# EasyEDA Pro project ProPrj_智能车主控V5.0-20251108_2026-08-26.epro, schematic Schematic1

## Sheets
1 Power: Board Name: Board1; Create Date: 2026-05-18; Page Name: P1; Project Name: 智能车主控V5.0-20251108; Schematic Name: Schematic1; Update Date: 2026-05-18; Company: 嘉立创EDA; Page Size: A4; Version: V1.0
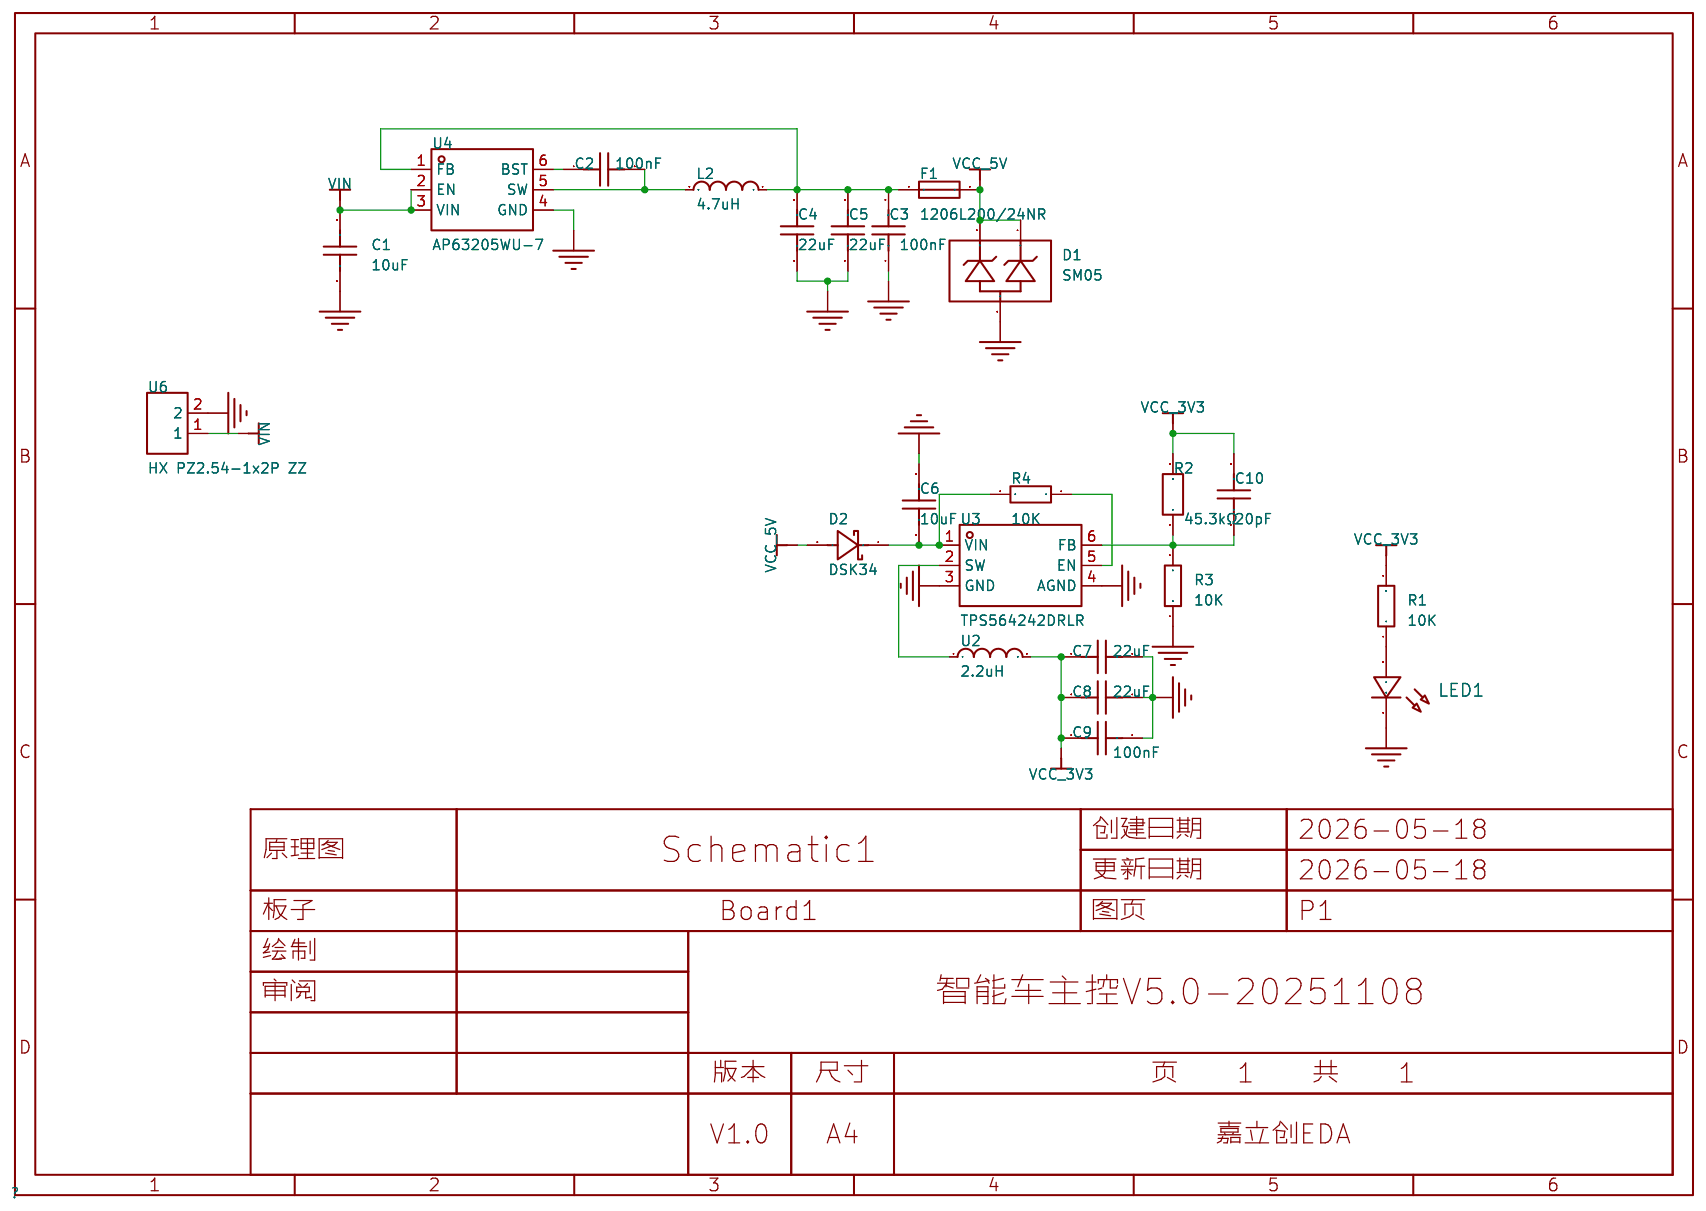
[diagram p5: Power]
2 MCU
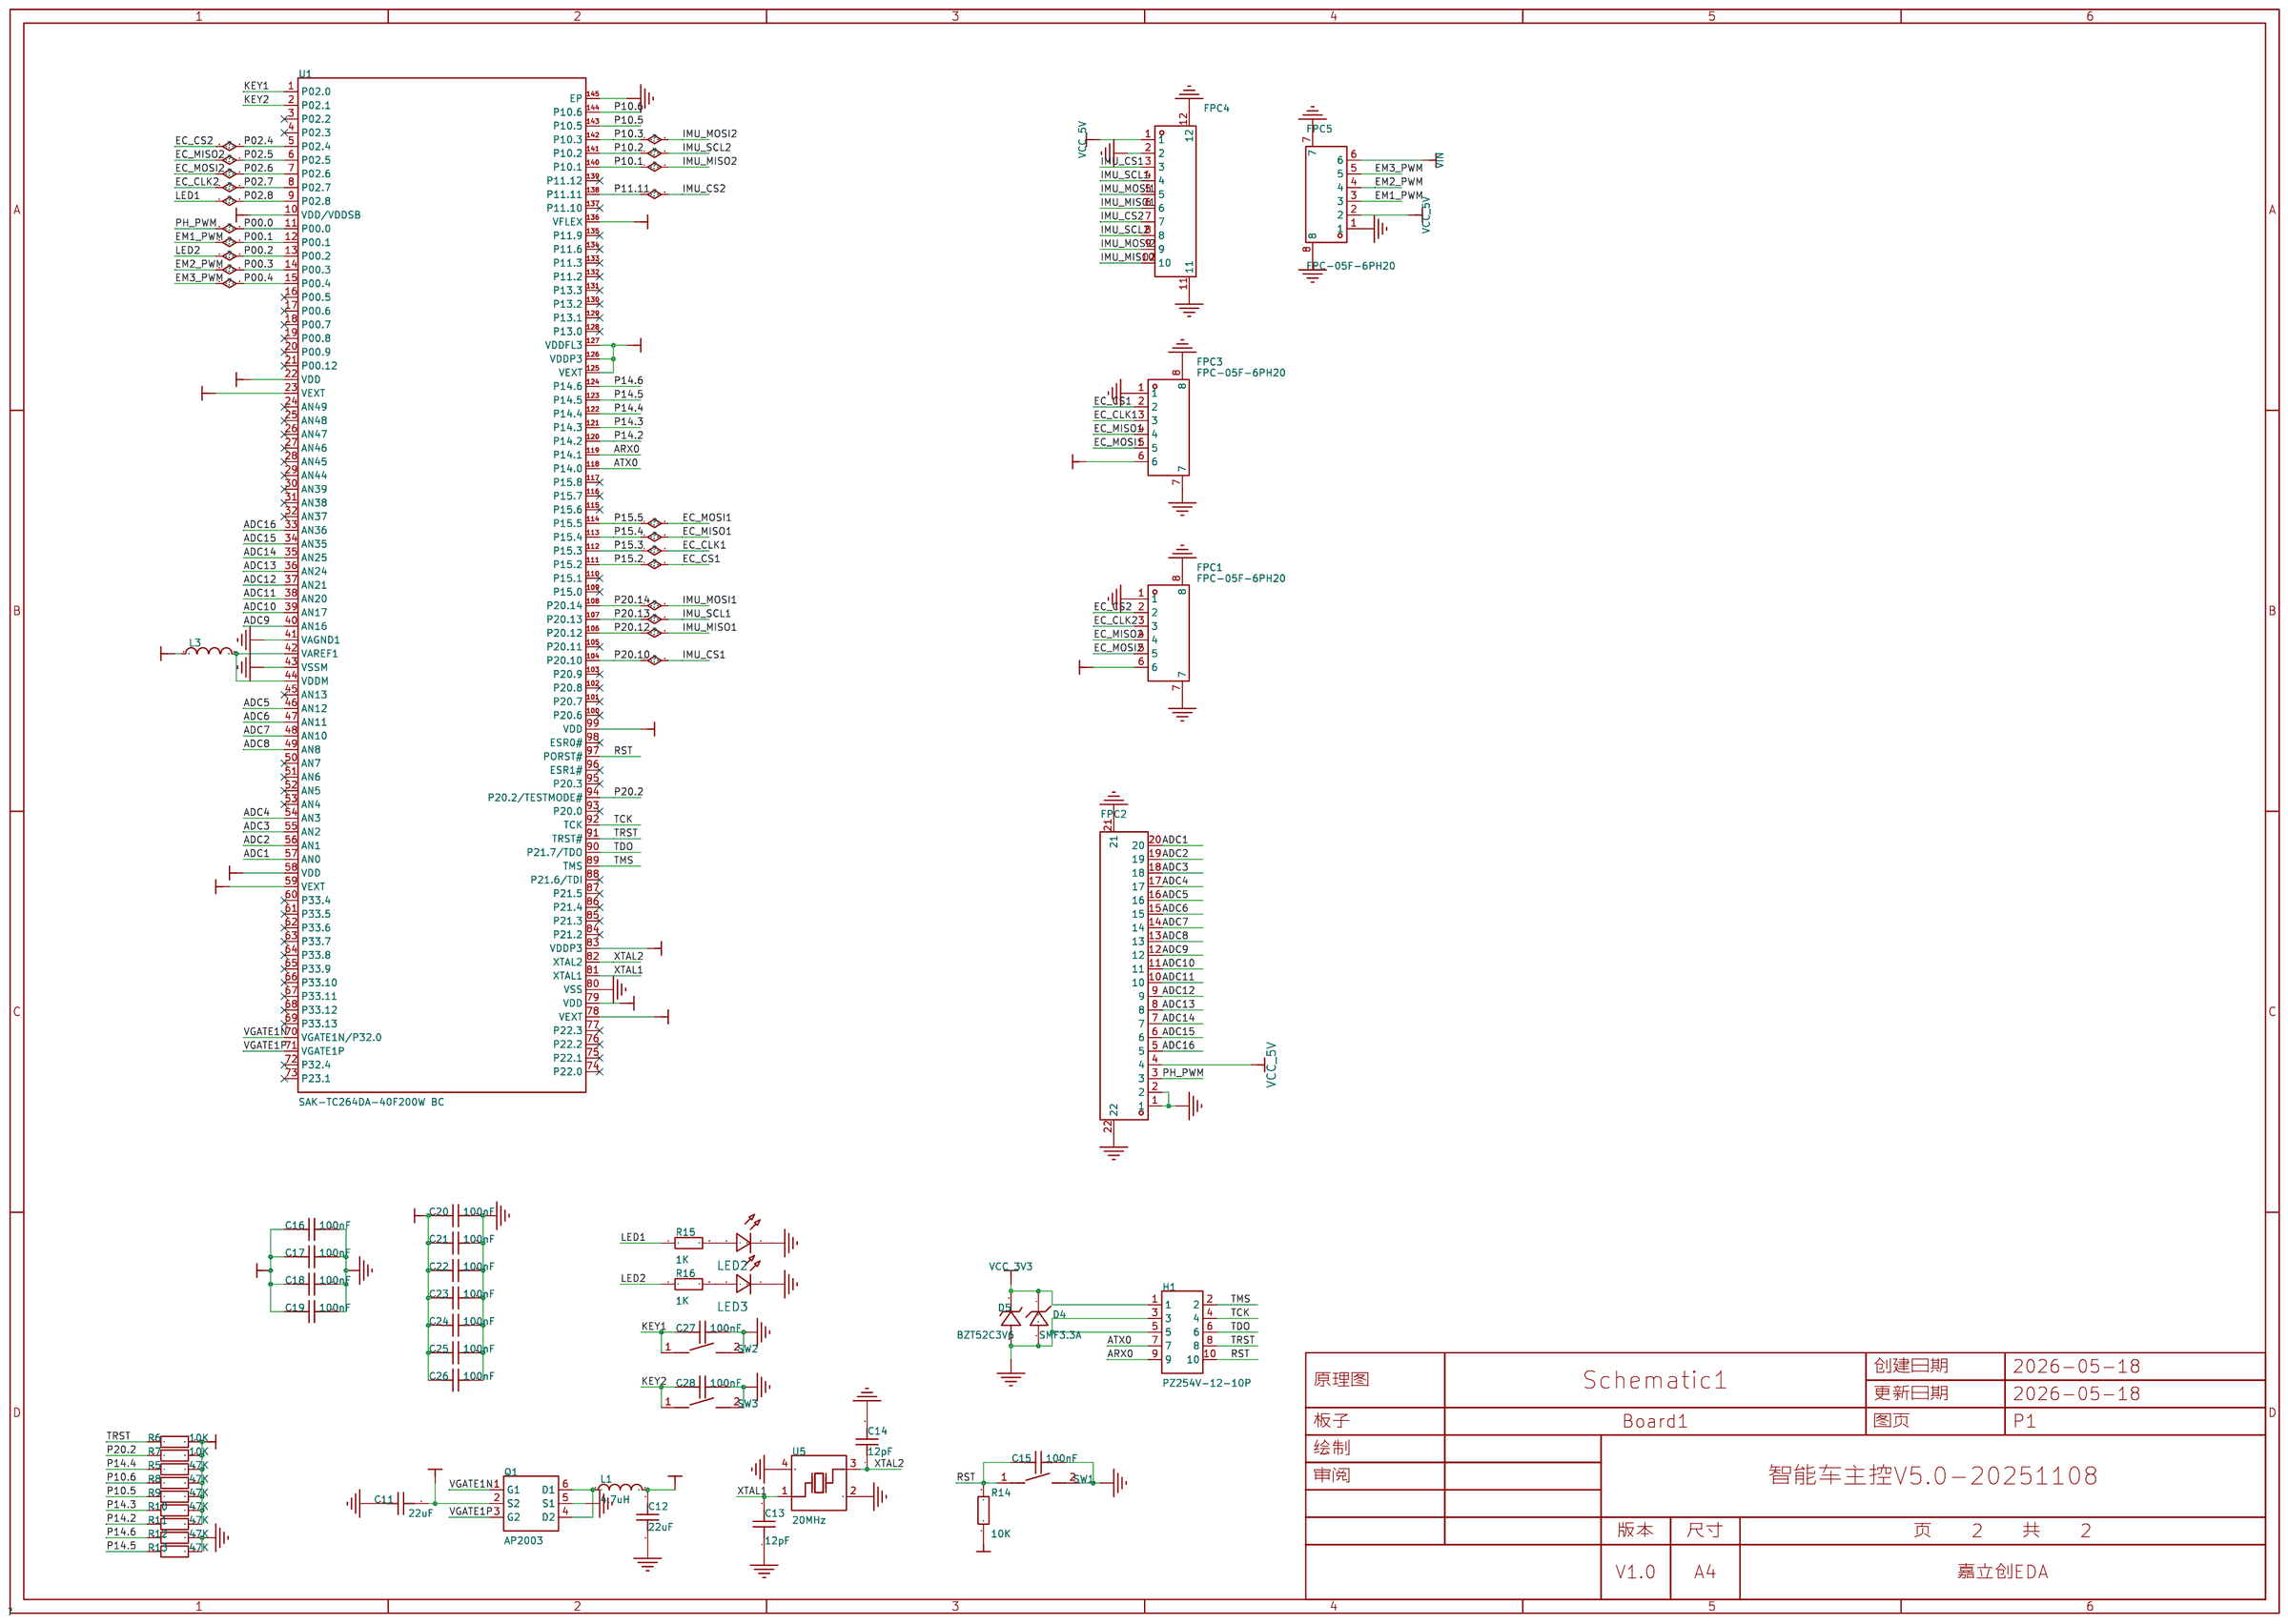
[diagram p6: MCU]

## Parts
sheet MCU
C11  22uF  [C0603]
C12  22uF  [C0603]
C13  12pF  [C0603]
C14  12pF  [C0603]
C15  100nF  [C0603]
C16  100nF  [C0603]
C17  100nF  [C0603]
C18  100nF  [C0603]
C19  100nF  [C0603]
C20  100nF  [C0603]
C21  100nF  [C0603]
C22  100nF  [C0603]
C23  100nF  [C0603]
C24  100nF  [C0603]
C25  100nF  [C0603]
C26  100nF  [C0603]
C27  100nF  [C0603]
C28  100nF  [C0603]
D4  SMF3.3A  [SOD-123_L2.8-W1.8-LS3.7-RD]
D5  BZT52C3V6  [SOD-123_L2.7-W1.6-LS3.7-RD]
FPC1  FPC-05F-6PH20  [FPC-SMD_6P-P0.50_XUNPU_FPC-05F-6PH20]
FPC2  FPC-05F-20PH20  [FPC-SMD_20P-P0.50_XUNPU_FPC-05F-20PH20]
FPC3  FPC-05F-6PH20  [FPC-SMD_6P-P0.50_XUNPU_FPC-05F-6PH20]
FPC4  FPC-05F-10PH15  [FPC-SMD_10P-P0.50_XUNPU_FPC-05F-10PH15]
FPC5  FPC-05F-6PH20  [FPC-SMD_6P-P0.50_XUNPU_FPC-05F-6PH20]
H1  PZ254V-12-10P  [HDR-TH_10P-P2.54-V-M-R2-C5-S2.54]
L1  4.7uH  [IND-SMD_L2.5-W2.0-VLS252012CX-150M]
L3  BLM18EG221SN1D  [L0603]
LED2  -  [LED_0603]
LED3  -  [LED_0603]
Q1  AP2003  [SOT-23-6_L2.9-W1.6-P0.95-LS2.8-BR]
R5  47K  [R0603]
R6  10K  [R0603]
R7  10K  [R0603]
R8  47K  [R0603]
R9  47K  [R0603]
R10  47K  [R0603]
R11  47K  [R0603]
R12  47K  [R0603]
R13  47K  [R0603]
R14  10K  [R0603]
R15  1K  [R0603]
R16  1K  [R0603]
SW1  TS-1088-AR02016  [SW-SMD_L3.9-W3.0-P4.45]
SW2  TS-1088-AR02016  [SW-SMD_L3.9-W3.0-P4.45]
SW3  TS-1088-AR02016  [SW-SMD_L3.9-W3.0-P4.45]
U1  SAK-TC264DA-40F200W BC  [LQFP-144_L20.0-W20.0-P0.50-LS22.0-BL-EP-1]
U5  20MHz  [CRYSTAL-SMD_4P-L2.0-W1.6-BL-2]
sheet Power
C1  10uF  [C0603]
C2  100nF  [C0603]
C3  100nF  [C0603]
C4  22uF  [C0603]
C5  22uF  [C0603]
C6  10uF  [C0603]
C7  22uF  [C0603]
C8  22uF  [C0603]
C9  100nF  [C0603]
C10  20pF  [C0603]
D1  SM05  [SOT-23-3_L2.9-W1.5-P1.90-LS2.6-BR]
D2  DSK34  [SOD-123FL_L2.7-W1.8-LS3.8-RD]
F1  1206L200/24NR  [F1206]
L2  4.7uH  [IND-SMD_L2.5-W2.0-VLS252012CX-150M]
LED1  -  [LED_0603]
R1  10K  [R0603]
R2  45.3kΩ  [R0603]
R3  10K  [R0603]
R4  10K  [R0603]
U2  2.2uH  [IND-SMD_L2.0-W1.6-B]
U3  TPS564242DRLR  [SOT-5X3-6_W1.6-L1.2-P0.50-LS1.6-BL]
U4  AP63205WU-7  [TSOT-23-6_L2.9-W1.6-P0.95-LS2.8-BL]
U6  HX PZ2.54-1x2P ZZ  [HDR-TH_2P-P2.54-V-M-3]

## Library data of the parts
C11-C28 = CAP_0603: Supplier Footprint: 0603
D4 = SMF3.3A_C283866: 极性:单向;反向截止电压(Vrwm):3.3V;钳位电压:8V;峰值脉冲电流(Ipp):25A;峰值脉冲功率(Ppp):200W@10/1000us;击穿电压:5.2V;; LCSC Part Name: 单向TVS 3.3V截止 峰值浪涌电流：25A; Supplier Part: C283866; Manufacturer: DOWO(东沃); Supplier Footprint: SOD-123FL; JLCPCB Part Class: Extended Part; Datasheet: https://item.szlcsc.com/datasheet/SMF3.3A/269417.html; Supplier: LCSC; Polarity: 单向; Reverse Stand-Off Voltage (Vrwm): 3.3V; Clamping Voltage: 8V; Peak Pulse Current (Ipp): 25A; Peak Pulse Power Dissipation (Ppp): 200W@10/1000us; Voltage - Breakdown: 5.2V; Reverse Leakage Current (Ir): 500uA; level of protection: IEC 61000-4-2；IEC 61000-4-4; Type: TVS
D5 = BZT52C3V6_C19077397: 二极管配置:独立式;稳压值(标称值):3.6V;稳压值(范围):3.42V~3.78V;耗散功率(Pd):350mW;; LCSC Part Name: 表面贴装齐纳二极管; Supplier Part: C19077397; Manufacturer: R+O(宏嘉诚); Supplier Footprint: SOD-123; JLCPCB Part Class: Extended Part; Datasheet: https://item.szlcsc.com/datasheet/BZT52C3V6/20275482.html; Supplier: LCSC; Diode Configuration: 独立式; Zener Voltage(Nom): 3.6V; Reverse Leakage Current (Ir): 5uA@1.0V; Zener Voltage(Range): 3.42V~3.78V; Pd - Power Dissipation: 350mW; Impedance(Zzt): 90Ω; Impedance(Zzk): 600Ω; Operating Junction Temperature Range: -55℃~+150℃
FPC1 FPC3 FPC5 = FPC-05F-6PH20: 锁定特性:翻盖式;触点类型:卧贴;触点数量:6P;间距:0.5mm;安装方式:下接;工作温度:-25℃~+85℃;; LCSC Part Name: 翻盖式 卧贴 P数:6P 间距:0.5mm; Supplier Part: C2856796; Manufacturer: XUNPU(讯普); Supplier Footprint: SMD,P=0.5mm,卧贴; JLCPCB Part Class: Extended Part; Datasheet: https://item.szlcsc.com/datasheet/FPC-05F-6PH20/3056894.html; Supplier: LCSC; Locking Feature: 翻盖式; Contact Type: 卧贴; Number of Contacts: 6P; Pitch: 0.5mm; Mounting Type: 下接; FFC, FCB Thickness: 0.3mm; Height Above Board: 2mm; Contact Material: 磷青铜; Contact Plating: 锡; Operating Temperature: -25℃~+85℃; Rated Voltage (Max): 50V; Current Rating (Max): 500mA
FPC2 = FPC-05F-20PH20: 锁定特性:翻盖式;触点类型:卧贴;触点数量:20P;间距:0.5mm;安装方式:下接;工作温度:-25℃~+85℃;; LCSC Part Name: 翻盖式 卧贴 P数:20P 间距:0.5mm; Supplier Part: C2856803; Manufacturer: XUNPU(讯普); Supplier Footprint: SMD,P=0.5mm,卧贴; JLCPCB Part Class: Extended Part; Datasheet: https://item.szlcsc.com/datasheet/FPC-05F-20PH20/3056901.html; Supplier: LCSC; Locking Feature: 翻盖式; Contact Type: 卧贴; Number of Contacts: 20P; Pitch: 0.5mm; Mounting Type: 下接; FFC, FCB Thickness: 0.3mm; Height Above Board: 2mm; Contact Material: 磷青铜; Contact Plating: 锡; Operating Temperature: -25℃~+85℃; Rated Voltage (Max): 50V; Current Rating (Max): 500mA
FPC4 = FPC-05F-10PH15: 锁定特性:翻盖式;触点类型:卧贴;触点数量:10P;间距:0.5mm;安装方式:下接;工作温度:-25℃~+85℃;; LCSC Part Name: 翻盖式 卧贴 P数:10P 间距:0.5mm; Supplier Part: C2856816; Manufacturer: XUNPU(讯普); Supplier Footprint: SMD,P=0.5mm,卧贴; JLCPCB Part Class: Extended Part; Datasheet: https://item.szlcsc.com/datasheet/FPC-05F-10PH15/3056914.html; Supplier: LCSC; Locking Feature: 翻盖式; Contact Type: 卧贴; Number of Contacts: 10P; Pitch: 0.5mm; Mounting Type: 下接; FFC, FCB Thickness: 0.3mm; Height Above Board: 1.5mm; Contact Material: 磷青铜; Contact Plating: 锡; Operating Temperature: -25℃~+85℃; Rated Voltage (Max): 50V; Current Rating (Max): 500mA
H1 = PZ254V-12-10P: 插针结构:2x5P;间距:2.54mm;行距:2.54mm;圆针/方针:方针;安装方式:直插;排数:双排;总PIN位数:10P;额定电流:-;额定电压:-;配合针长度:6mm;塑高:2.5mm;端接针长度:3mm;触头材质:黄铜;触头镀层:-;工作温度:-40℃~+105℃;颜色:黑色;; LCSC Part Name: 2x5P 间距:2.54mm 方针 直插; Supplier Part: C492422; Manufacturer: XFCN(兴飞); Supplier Footprint: 插件,P=2.54mm; JLCPCB Part Class: Extended Part; Datasheet: https://item.szlcsc.com/datasheet/PZ254V-12-10P/502978.html; Supplier: LCSC; Pin Structure: 2x5P; Pitch: 2.54mm; Row Spacing: 2.54mm; Circluar Pins/Square Pins: 方针; Mounting Type: 直插; Number of Rows: 双排; Number of Pins: 10P; Length of Mating Pin: 6mm; Insulation Height: 2.5mm; Length of End Connection Pin: 3mm; Contact Material: 黄铜; Operating Temperature: -40℃~+105℃; Color: 黑色
L1 L2 = FTC252010S4R7MBCA: 电感值:4.7uH;精度:±20%;额定电流:2A;饱和电流(Isat):2.6A;类型:-;; LCSC Part Name: 4.7uH ±20% 2.6A; Supplier Part: C5832360; Manufacturer: cjiang(长江微电); Supplier Footprint: 1008; JLCPCB Part Class: Extended Part; Datasheet: https://item.szlcsc.com/datasheet/FTC252010S4R7MBCA/6763480.html; Supplier: LCSC; Tolerance: ±20%; Current Rating: 2A; Current - Saturation(Isat): 2.6A; DC Resistance(DCR): 160mΩ
L3 = BLM18EG221SN1D: 阻抗@频率:220Ω@100MHz;误差:±25%;直流电阻(DCR):50mΩ;; LCSC Part Name: 单路 0603磁珠 阻抗220Ω@100MHz; Supplier Part: C85827; Manufacturer: muRata(村田); Supplier Footprint: 0603; JLCPCB Part Class: Extended Part; Datasheet: https://item.szlcsc.com/datasheet/BLM18EG221SN1D/87003.html; Supplier: LCSC; Impedance @ Frequency: 220Ω@100MHz; Tolerance: ±25%; DC Resistance(DCR): 50mΩ; Current Rating: 2A; Number of Circuits: 1; Operating Temperature: -55℃~+125℃
LED1-LED3 = LED_0603-R: Supplier Footprint: 0603
Q1 = AP2003: 数量:1个N沟道+1个P沟道;漏源电压(Vdss):20V;连续漏极电流(Id):3A;导通电阻(RDS(on)):100mΩ@2.5V;耗散功率(Pd):800mW;阈值电压(Vgs(th)):1.2V@250uA;; LCSC Part Name: 1个N沟道+1个P沟道 耐压:20V 电流:3A; Supplier Part: C2849575; Manufacturer: ALLPOWER(铨力); Supplier Footprint: SOT-23-6L; JLCPCB Part Class: Extended Part; Datasheet: https://item.szlcsc.com/datasheet/AP2003/3049192.html; Supplier: LCSC; Number: 1个N沟道+1个P沟道; Drain to Source Voltage: 20V; Current - Continuous Drain(Id): 3A; RDS(on): 100mΩ@2.5V; Pd - Power Dissipation: 800mW; Gate Threshold Voltage (Vgs(th)): 1.2V@250uA; Gate Charge(Qg): 5nC@4.5V; Input Capacitance(Ciss): 325pF; Reverse Transfer Capacitance (Crss@Vds): 37pF; Operating Temperature: -55℃~+150℃; Type: N沟道+P沟道; Output Capacitance(Coss): 63pF
R5-R16 = Res_0603: Supplier Footprint: 0603
SW1-SW3 = TS-1088-AR02016: 电路结构:单刀单掷;按钮形状:圆形按钮;作用力:1.6N;安装方式:立贴;开关长度:4mm;开关宽度:3mm;开关高度:2mm;带支架:不带支架;触点电流:50mA;额定电压:12V;工作寿命:10万次;; LCSC Part Name: 4*3*2mm 立贴 轻触开关; Supplier Part: C720477; Manufacturer: XUNPU(讯普); Supplier Footprint: SMD,4x3mm; JLCPCB Part Class: Basic Part; Datasheet: https://item.szlcsc.com/datasheet/TS-1088-AR02016/763484.html; Supplier: LCSC; Circuit: 单刀单掷; Actuator Style: 圆形按钮; Operating Force: 1.6N; Mounting Type: 立贴; Length: 4mm; Width: 3mm; Switch Height: 2mm; with Bracket: 不带支架; Contact Current: 50mA; Voltage Rating: 12V; Actuator/Cap Color: 黑色; Termination Style: SMD接片; Life: 10万次; Operating Temperature: -30℃~+80℃
U1 = SAK-TC264DA-40F200W BC: Supplier Part: C538798; Manufacturer: Infineon(英飞凌); Supplier Footprint: LQFP-144(20x20); JLCPCB Part Class: Extended Part; Supplier: LCSC
U5 = 8Y20000007: 频率:20MHz;常温频差:±10ppm;负载电容:12pF;; LCSC Part Name: 20MHz ±10ppm 12pF; Supplier Part: C5203645; Manufacturer: TXC(晶技); Supplier Footprint: SMD2016-4P; JLCPCB Part Class: Extended Part; Datasheet: https://atta.szlcsc.com/upload/public/pdf/source/20240312/50B2E56C424AFD010D570C51FD18DC59.pdf; Supplier: LCSC; Normal temperature Frequency Tolerance: ±10ppm; Load Capacitance: 12pF; Operating Temperature: -30℃~+90℃
C1 C6 = GRM188R6YA106MA73D: 容值:10uF;精度:±20%;额定电压:35V;材质(温度系数):X5R;; LCSC Part Name: 10uF ±20% 35V; Supplier Part: C194427; Manufacturer: muRata(村田); Supplier Footprint: 0603; JLCPCB Part Class: Extended Part; Datasheet: https://atta.szlcsc.com/upload/public/pdf/source/20210128/C194427_FCA3640823207DDB58700A82F1A19B5F.pdf; Supplier: LCSC; Tolerance: ±20%; Voltage Rated: 35V; Temperature Coefficient: X5R
C2 C3 C9 = CL05B104KB54PNC: 容值:100nF;精度:±10%;额定电压:50V;温度系数:X7R;; LCSC Part Name: 100nF ±10% 50V; Supplier Part: C307331; Manufacturer: SAMSUNG(三星); Supplier Footprint: 0402; JLCPCB Part Class: Basic Part; Datasheet: https://item.szlcsc.com/datasheet/CL05B104KB54PNC/291005.html; Supplier: LCSC; Tolerance: ±10%; Voltage Rating: 50V; Temperature Coefficient: X7R
C4 C5 C7 C8 = CGA0603X5R226M160JT: 容值:22uF;精度:±20%;额定电压:16V;温度系数:X5R;; LCSC Part Name: 22uF ±20% 16V; Supplier Part: C6119868; Manufacturer: HRE(芯声); Supplier Footprint: 0603; JLCPCB Part Class: Extended Part; Datasheet: https://item.szlcsc.com/datasheet/CGA0603X5R226M160JT/7062574.html; Supplier: LCSC; Tolerance: ±20%; Voltage Rating: 16V; Temperature Coefficient: X5R
C10 = FCC0402N200J500AT: 容值:20pF;精度:±5%;额定电压:50V;温度系数:C0G;; LCSC Part Name: 20pF ±5% 50V; Supplier Part: C5137579; Manufacturer: FOJAN(富捷); Supplier Footprint: 0402; JLCPCB Part Class: Extended Part; Datasheet: https://item.szlcsc.com/datasheet/FCC0402N200J500AT/5747031.html; Supplier: LCSC; Tolerance: ±5%; Voltage Rating: 50V; Temperature Coefficient: C0G
D1 = SM05_C502559: 极性:-;反向截止电压(Vrwm):5V;钳位电压:18V;峰值脉冲电流(Ipp):17A;峰值脉冲功率(Ppp):350W;击穿电压:6V;; LCSC Part Name: 5V截止 峰值脉冲电流：17A; Supplier Part: C502559; Manufacturer: MDD(辰达半导体); Supplier Footprint: SOT-23; JLCPCB Part Class: Extended Part; Datasheet: https://item.szlcsc.com/datasheet/SM05/515065.html; Supplier: LCSC; Reverse Stand-Off Voltage (Vrwm): 5V; Clamping Voltage: 18V; Peak Pulse Current (Ipp): 17A; Peak Pulse Power Dissipation (Ppp): 350W; Voltage - Breakdown: 6V; Reverse Leakage Current (Ir): 10uA; Operating Temperature: -55℃~+150℃; level of protection: IEC 61000-4-2；IEC 61000-4-4; Type: ESD; Junction Capacitance: 10pF
D2 = DSK34_C727076: 二极管配置:独立式;正向压降(Vf):520mV@3A;直流反向耐压(Vr):40V;整流电流:3A;; LCSC Part Name: 电压:40V 电流:3A; Supplier Part: C727076; Manufacturer: TWGMC(迪嘉); Supplier Footprint: SOD-123FL; JLCPCB Part Class: Extended Part; Datasheet: https://item.szlcsc.com/datasheet/DSK34/774181.html; Supplier: LCSC; Diode Configuration: 独立式; Voltage - Forward(Vf@If): 520mV@3A; Voltage - DC Reverse(Vr): 40V; Current - Rectified: 3A; Reverse Leakage Current (Ir): 500uA; Operating Junction Temperature Range: -55℃~+125℃; Non-Repetitive Peak Forward Surge Current: 80A
F1 = 1206L200/24NR: 耐压(Vmax):24V;最大电流(Imax):40A;保持电流(Ihold):2A;跳闸电流(Itrip):3.5A;; LCSC Part Name: 24V 2.00A 1206 自恢复; Supplier Part: C42396578; Manufacturer: LUTE(陆特); Supplier Footprint: 1206; JLCPCB Part Class: Extended Part; Datasheet: https://item.szlcsc.com/datasheet/1206L200%252F24NR/44344788.html; Supplier: LCSC; Voltage - Max: 24V; Current - Max: 40A; Hold Current: 2A; Trip Current: 3.5A; Power Dissipation: 1.2W; Resistance - Initial (Ri) (Min): 15mΩ; Resistance - Post Trip (R1) (Max): 80mΩ; Time to Trip(Max): 1.5s; Operating Temperature: -40℃~+85℃; Length: 3.6mm; Width: 1.9mm; Height: 1.6mm
R1 R3 R4 = Res_0402: Supplier Footprint: 0402
R2 = FRC0402F4532TS: 电阻类型:厚膜电阻;阻值:45.3kΩ;精度:±1%;功率:62.5mW;工作电压:50V;温度系数:±100ppm/℃;; LCSC Part Name: 45.3kΩ ±1% 62.5mW 厚膜电阻; Supplier Part: C2933099; Manufacturer: FOJAN(富捷); Supplier Footprint: 0402; JLCPCB Part Class: Extended Part; Supplier: LCSC; Type: 厚膜电阻; Tolerance: ±1%; Power(Watts): 62.5mW; Voltage-Supply(Max): 50V; Temperature Coefficient: ±100ppm/℃; Operating Temperature: -55℃~+155℃
U2 = FTC201610S2R2MBCA: 电感值:2.2uH;精度:±20%;额定电流:2.5A;饱和电流(Isat):3A;类型:-;; LCSC Part Name: 2.2uH ±20% 3A; Supplier Part: C5832344; Manufacturer: cjiang(长江微电); Supplier Footprint: 0806; JLCPCB Part Class: Extended Part; Datasheet: https://item.szlcsc.com/datasheet/FTC201610S2R2MBCA/6763464.html; Supplier: LCSC; Tolerance: ±20%; Current Rating: 2.5A; Current - Saturation(Isat): 3A; DC Resistance(DCR): 120mΩ
U3 = TPS564242DRLR: 功能类型:降压型;工作电压:3V~16V;输出电压:600mV~7V;输出电流:4A;输出类型:可调;; LCSC Part Name: 采用SOT-563封装、具有3V至16V输入电压的4A同步降压转换器; Supplier Part: C5219267; Manufacturer: TI(德州仪器); Supplier Footprint: SOT-563; JLCPCB Part Class: Extended Part; Datasheet: https://www.ti.com/cn/lit/gpn/tps564242; Supplier: LCSC; Function: 降压型; Voltage - Supply: 3V~16V; Output Voltage: 600mV~7V; Output Current: 4A; Frequency - Switching: 1.2MHz; Operating Temperature: -40℃~+125℃@(TJ); Synchronous Rectifier: 是; Number of Outputs: 1; Topology: 降压式; Quiescent Current: 120uA; Switch tube (built-in/external): 内置; Output Type: 可调
U4 = AP63205WU-7: 功能类型:降压型;工作电压:3.8V~32V;输出电压:5V;输出电流:2A;输出类型:固定;; LCSC Part Name: 3.8V至32V输入、2A低静态电流同步降压转换器，增强EMI抑制; Supplier Part: C2071056; Manufacturer: DIODES(美台); Supplier Footprint: TSOT-23-6; JLCPCB Part Class: Extended Part; Datasheet: https://item.szlcsc.com/datasheet/AP63205WU-7/2162639.html; Supplier: LCSC; Function: 降压型; Voltage - Supply: 3.8V~32V; Output Voltage: 5V; Output Current: 2A; Frequency - Switching: 1.1MHz; Operating Temperature: -40℃~+85℃@(TA); Synchronous Rectifier: 是; Number of Outputs: 1; Topology: 降压式; Quiescent Current: 22uA; Switch tube (built-in/external): 内置; Output Type: 固定
U6 = HX PZ2.54-1x2P ZZ: 插针结构:1x2P;间距:2.54mm;行距:-;圆针/方针:方针;安装方式:直插;排数:单排;总PIN位数:2P;额定电流:3A;额定电压:1kV;配合针长度:6mm;塑高:2.5mm;端接针长度:3mm;触头材质:黄铜;触头镀层:金;工作温度:-40℃~+105℃;颜色:黑色;; LCSC Part Name: 1x2P 间距:2.54mm 方针 直插; Supplier Part: C32713268; Manufacturer: hanxia(韩下); Supplier Footprint: 插件,P=2.54mm; JLCPCB Part Class: Extended Part; Datasheet: https://item.szlcsc.com/datasheet/HX%2520PZ2.54-1x2P%2520ZZ/34444548.html; Supplier: LCSC; Pin Structure: 1x2P; Pitch: 2.54mm; Circluar Pins/Square Pins: 方针; Mounting Type: 直插; Number of Rows: 单排; Number of Pins: 2P; Current Rating: 3A; Voltage Rating (Max): 1kV; Length of Mating Pin: 6mm; Insulation Height: 2.5mm; Length of End Connection Pin: 3mm; Contact Material: 黄铜; Contact Plating: 金; Operating Temperature: -40℃~+105℃; Color: 黑色

## Nets
GND: C1.1 C3.1 C4.1 C5.1 C6.2 C7.1 C8.1 C9.1 C11.1 C12.1 C13.1 C14.2 C15.1 C16.2 C17.2 C18.2 C19.2 C20.2 C21.2 C22.2 C23.2 C24.2 C25.2 C26.2 C27.1 C28.1 D1.3 D4.2 D5.2(A) FPC1.1 FPC1.7 FPC1.8 FPC2.1 FPC2.2 FPC2.21 FPC2.22 FPC3.1 FPC3.7 FPC3.8 FPC4.2 FPC4.11 FPC4.12 FPC5.1 FPC5.7 FPC5.8 H1.3 H1.5 LED1.1(C) LED2.1(C) LED3.1(C) Q1.5(S1) R3.1 R12.2 R13.2 SW1.2 SW2.2 SW3.2 U1.41(VAGND1) U1.43(VSSM) U1.80(VSS) U1.145(EP) U3.3(GND) U3.4(AGND) U4.4(GND) U5.2(GND) U5.4(GND) U6.2
VCC_1V3: C12.2 C16.1 C17.1 C18.1 C19.1 L1.2 U1.10(VDD/VDDSB) U1.22(VDD) U1.58(VDD) U1.79(VDD) U1.99(VDD)
VCC_3V3: C7.2 C8.2 C9.2 C10.2 C11.2 C20.1 C21.1 C22.1 C23.1 C24.1 C25.1 C26.1 D4.1 D5.1(K) FPC1.6 FPC3.6 H1.1 L3.1 Q1.2(S2) R1.2 R2.2 R5.2 R6.2 R7.2 R8.2 R9.2 R10.2 R11.2 R14.1 U1.23(VEXT) U1.59(VEXT) U1.78(VEXT) U1.83(VDDP3) U1.125(VEXT) U1.126(VDDP3) U1.127(VDDFL3) U1.136(VFLEX) U2.2
VCC_5V: D1.1 D1.2 D2.2(A) F1.2 FPC2.4 FPC4.1 FPC5.2
VIN: C1.2 FPC5.6 U4.2(EN) U4.3(VIN) U6.1
ADC1: FPC2.20 U1.57(AN0)
ADC2: FPC2.19 U1.56(AN1)
ADC3: FPC2.18 U1.55(AN2)
ADC4: FPC2.17 U1.54(AN3)
ADC5: FPC2.16 U1.46(AN12)
ADC6: FPC2.15 U1.47(AN11)
ADC7: FPC2.14 U1.48(AN10)
ADC8: FPC2.13 U1.49(AN8)
ADC9: FPC2.12 U1.40(AN16)
ADC10: FPC2.11 U1.39(AN17)
ADC11: FPC2.10 U1.38(AN20)
ADC12: FPC2.9 U1.37(AN21)
ADC13: FPC2.8 U1.36(AN24)
ADC14: FPC2.7 U1.35(AN25)
ADC15: FPC2.6 U1.34(AN35)
ADC16: FPC2.5 U1.33(AN36)
ARX0: H1.9 U1.119(P14.1)
ATX0: H1.7 U1.118(P14.0)
EC_CLK1: FPC3.3 U1.112(P15.3)
EC_CLK2: FPC1.3 U1.8(P02.7)
EC_CS1: FPC3.2 U1.111(P15.2)
EC_CS2: FPC1.2 U1.5(P02.4)
EC_MISO1: FPC3.4 U1.113(P15.4)
EC_MISO2: FPC1.4 U1.6(P02.5)
EC_MOSI1: FPC3.5 U1.114(P15.5)
EC_MOSI2: FPC1.5 U1.7(P02.6)
EM1_PWM: FPC5.3 U1.12(P00.1)
EM2_PWM: FPC5.4 U1.14(P00.3)
EM3_PWM: FPC5.5 U1.15(P00.4)
IMU_CS1: FPC4.3 U1.104(P20.10)
IMU_CS2: FPC4.7 U1.138(P11.11)
IMU_MISO1: FPC4.6 U1.106(P20.12)
IMU_MISO2: FPC4.10 U1.140(P10.1)
IMU_MOSI1: FPC4.5 U1.108(P20.14)
IMU_MOSI2: FPC4.9 U1.142(P10.3)
IMU_SCL1: FPC4.4 U1.107(P20.13)
IMU_SCL2: FPC4.8 U1.141(P10.2)
KEY1: C27.2 SW2.1 U1.1(P02.0)
KEY2: C28.2 SW3.1 U1.2(P02.1)
LED1: R15.1 U1.9(P02.8)
LED2: R16.1 U1.13(P00.2)
P00.0: FPC2.3 U1.11(P00.0)
P10.5: R9.1 U1.143(P10.5)
P10.6: R8.1 U1.144(P10.6)
P14.2: R11.1 U1.120(P14.2)
P14.3: R10.1 U1.121(P14.3)
P14.4: R5.1 U1.122(P14.4)
P14.5: R13.1 U1.123(P14.5)
P14.6: R12.1 U1.124(P14.6)
P20.2: R7.1 U1.94(P20.2/TESTMODE#)
RST: C15.2 H1.10 R14.2 SW1.1 U1.97(PORST#)
TCK: H1.4 U1.92(TCK)
TDO: H1.6 U1.90(P21.7/TDO)
TMS: H1.2 U1.89(TMS)
TRST: H1.8 R6.1 U1.91(TRST#)
VGATE1N: Q1.1(G1) U1.70(VGATE1N/P32.0)
VGATE1P: Q1.3(G2) U1.71(VGATE1P)
XTAL1: C13.2 U1.81(XTAL1) U5.1(OSC1)
XTAL2: C14.1 U1.82(XTAL2) U5.3(OSC2)
$1N3: C10.1 R2.1 R3.2 U3.6(FB)
$1N4: R4.1 U3.5(EN)
$1N9: U2.1 U3.2(SW)
$1N11: C6.1 D2.1(K) R4.2 U3.1(VIN)
$1N15: LED1.2(A) R1.1
$1N23: C3.2 C4.2 C5.2 F1.1 L2.1 U4.1(FB)
$1N24: C2.2 L2.2 U4.5(SW)
$1N25: C2.1 U4.6(BST)
$2N13: L1.1 Q1.4(D2) Q1.6(D1)
$2N36: L3.2 U1.42(VAREF1) U1.44(VDDM)
$2N229: LED2.2(A) R15.2
$2N232: LED3.2(A) R16.2

Not connected (* = marked no-connect by the designer): U1 3(P02.2)* 4(P02.3)* 16(P00.5)* 17(P00.6)* 18(P00.7)* 19(P00.8)* 20(P00.9)* 21(P00.12)* 24(AN49)* 25(AN48)* 26(AN47)* 27(AN46)* 28(AN45)* 29(AN44)* 30(AN39)* 31(AN38)* 32(AN37)* 45(AN13)* 50(AN7)* 51(AN6)* 52(AN5)* 53(AN4)* 60(P33.4)* 61(P33.5)* 62(P33.6)* 63(P33.7)* 64(P33.8)* 65(P33.9)* 66(P33.10)* 67(P33.11)* 68(P33.12)* 69(P33.13)* 72(P32.4)* 73(P23.1)* 74(P22.0)* 75(P22.1)* 76(P22.2)* 77(P22.3)* 84(P21.2)* 85(P21.3)* 86(P21.4)* 87(P21.5)* 88(P21.6/TDI)* 93(P20.0)* 95(P20.3)* 96(ESR1#)* 98(ESR0#)* 100(P20.6)* 101(P20.7)* 102(P20.8)* 103(P20.9)* 105(P20.11)* 109(P15.0)* 110(P15.1)* 115(P15.6)* 116(P15.7)* 117(P15.8)* 128(P13.0)* 129(P13.1)* 130(P13.2)* 131(P13.3)* 132(P11.2)* 133(P11.3)* 134(P11.6)* 135(P11.9)* 137(P11.10)* 139(P11.12)*
